# EAGLE design ME433_Spring2017 (EAGLE 8.1.0)
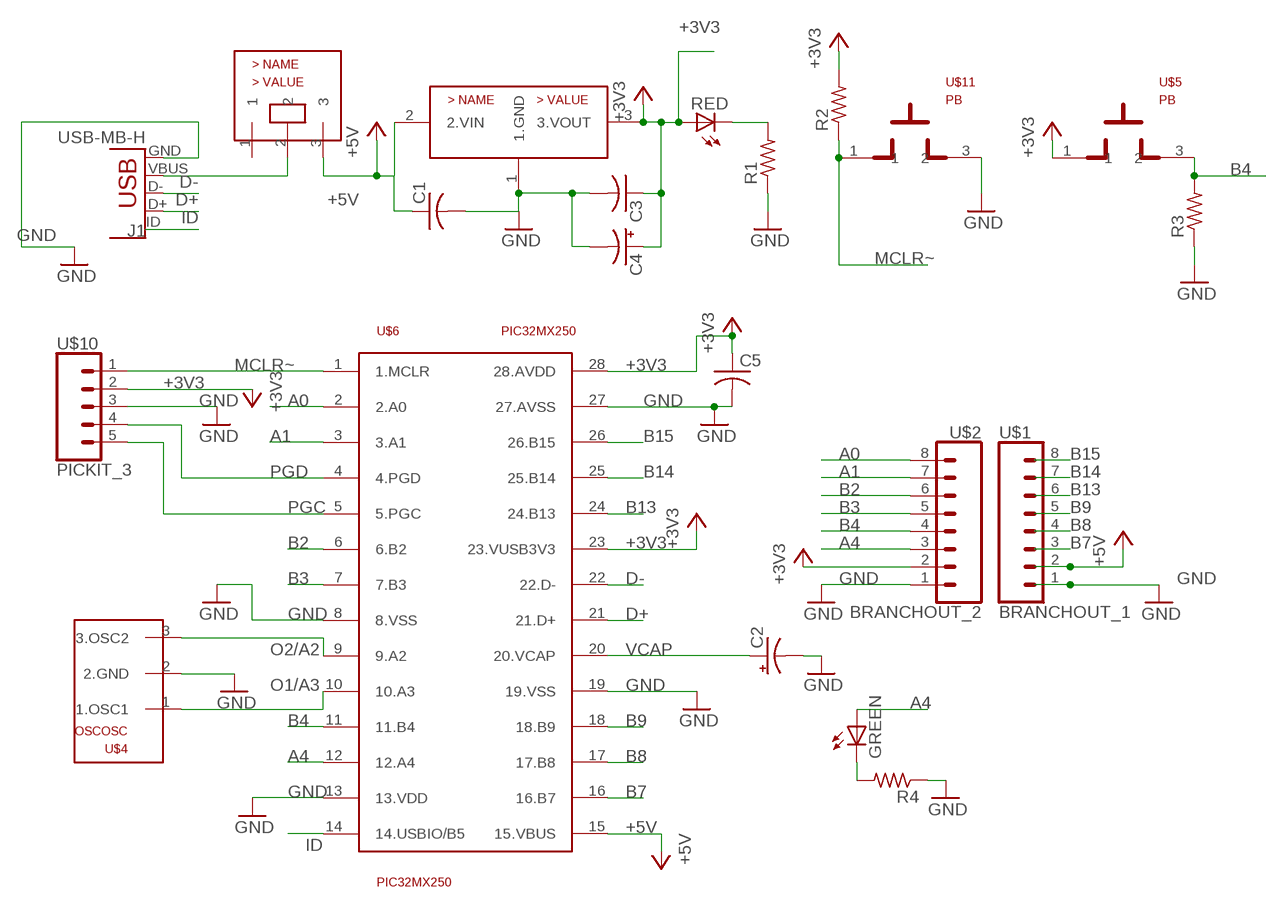
[diagram p0: schematic, sheet 1]

## Parts
_  MCP1702  [TO92]
C1  C-US025-025X050  [C025-025X050]
C2  CPOL-USB45181B  [B45181B]
C3  C-US025-025X050  [C025-025X050]
C4  CPOL-USB45181B  [B45181B]
C5  C-US025-025X050  [C025-025X050]
GREEN  LED3MM  [LED3MM]
J1  USB-MB-H  [USB-MB-H]
R1  R-US_0204/7  [0204/7]
R2  R-US_0204/7  [0204/7]
R3  R-US_0204/7  [0204/7]
R4  R-US_0204/7  [0204/7]
RED  LED3MM  [LED3MM]
U$1  BRANCHOUT_1  [1X08]
U$2  BRANCHOUT_2  [1X08]
U$4  OSCOSC  [OSC]
U$5  PB  [PB]
U$6  PIC32MX250  [DIL28-3]
U$8  SLIDE  [SLIDE]
U$10  PICKIT_3  [1X05]
U$11  PB  [PB]

## Nets
+3V3: _.3(3.VOUT) C3.1 C4.+ C5.1 R2.2 RED.A U$2.2 U$5.1 U$6.23(23.VUSB3V3) U$6.28(28.AVDD) U$10.2(2.VDD)
+5V: _.2(2.VIN) C1.1 U$1.2 U$6.15(15.VBUS) U$8.3
A0: U$2.8 U$6.2(2.A0)
A1: U$2.7 U$6.3(3.A1)
A4: GREEN.A U$2.3 U$6.12(12.A4)
B2: U$2.6 U$6.6(6.B2)
B3: U$2.5 U$6.7(7.B3)
B4: R3.2 U$2.4 U$5.3 U$6.11(11.B4)
B7: U$1.3 U$6.16(16.B7)
B8: U$1.4 U$6.17(17.B8)
B9: U$1.5 U$6.18(18.B9)
B13: U$1.6 U$6.24(24.B13)
B14: U$1.7 U$6.25(25.B14)
B15: U$1.8 U$6.26(26.B15)
D+: J1.D+ U$6.21(21.D+)
D-: J1.D- U$6.22(22.D-)
GND: _.1(1.GND) C1.2 C2.- C3.2 C4.- C5.2 J1.GND R1.1 R3.1 R4.1 U$1.1 U$2.1 U$4.2(2.GND) U$6.8(8.VSS) U$6.13(13.VDD) U$6.19(19.VSS) U$6.27(27.AVSS) U$10.3(3.VSS) U$11.3
ID: J1.ID U$6.14(14.USBIO/B5)
MCLR~: R2.1 U$6.1(1.MCLR) U$10.1(1.MCLR~) U$11.1
N$1: J1.VBUS U$8.2
N$18: R1.2 RED.K(C)
N$23: GREEN.K(C) R4.2
O1/A3: U$4.1(1.OSC1) U$6.10(10.A3)
O2/A2: U$4.3(3.OSC2) U$6.9(9.A2)
PGC: U$6.5(5.PGC) U$10.5(5.PGC)
PGD: U$6.4(4.PGD) U$10.4(4.PGD)
VCAP: C2.+ U$6.20(20.VCAP)
Unconnected: U$8.1

## Library data of the parts
_ = ME433_Spring2017:MCP1702
C1 C3 C5 = ME433_Spring2017:C-US: CAPACITOR, American symbol
C2 C4 = ME433_Spring2017:CPOL-US: POLARIZED CAPACITOR, American symbol
GREEN RED = ME433_Spring2017:LED: LED OSRAM: - CHIPLED LG R971, LG N971, LY N971, LG Q971, LY Q971, LO R971, LY R971 LH N974, LH R974 LS Q976, LO Q976, LY Q976 LO Q996 - Hyper CHIPLED LW Q18S LB Q993, LB Q99A, LB R99A - SideLED LS A670, LO A670, LY A670, LG A670, LP A670 LB A673, LV A673, LT A673, LW A673 LH A674 LY A675 LS A676, LA A676, LO A676, LY A676, LW A676 LS A679, LY A679, LG A679 - Hyper Micro SIDELED® LS Y876, LA Y876, LO Y876, LY Y876 LT Y87S - SmartLED LW L88C, LW L88S LB L89C, LB L89S, LG L890 LS L89K, LO L89K, LY L89K LS L896, LA L896, LO L896, LY L896 - TOPLED LS T670, LO T670, LY T670, LG T670, LP T670 LSG T670, LSP T670, LSY T670, LOP T670, LYG T670 LG T671, LOG T671, LSG T671 LB T673, LV T673, LT T673, LW T673 LH T674 LS T676, LA T676, LO T676, LY T676, LB T676, LH T676, LSB T676, LW T676 LB T67C, LV T67C, LT T67C, LS T67K, LO T67K, LY T67K, LW E67C LS E67B, LA E67B, LO E67B, LY E67B, LB E67C, LV E67C, LT E67C LW T67C LS T679, LY T679, LG T679 LS T770, LO T770, LY T770, LG T770, LP T770 LB T773, LV T773, LT T773, LW T773 LH T774 LS E675, LA E675, LY E675, LS T675 LS T776, LA T776, LO T776, LY T776, LB T776 LHGB T686 LT T68C, LB T68C - Hyper Mini TOPLED® LB M676 - Mini TOPLED Santana® LG M470 LS M47K, LO M47K, LY M47K Source: http://www.osram.convergy.de LUXEON: - LUMILED® LXK2-PW12-R00, LXK2-PW12-S00, LXK2-PW14-U00, LXK2-PW14-V00 LXK2-PM12-R00, LXK2-PM12-S00, LXK2-PM14-U00 LXK2-PE12-Q00, LXK2-PE12-R00, LXK2-PE12-S00, LXK2-PE14-T00, LXK2-PE14-U00 LXK2-PB12-K00, LXK2-PB12-L00, LXK2-PB12-M00, LXK2-PB14-N00, LXK2-PB14-P00, LXK2-PB14-Q00 LXK2-PR12-L00, LXK2-PR12-M00, LXK2-PR14-Q00, LXK2-PR14-R00 LXK2-PD12-Q00, LXK2-PD12-R00, LXK2-PD12-S00 LXK2-PH12-R00, LXK2-PH12-S00 LXK2-PL12-P00, LXK2-PL12-Q00, LXK2-PL12-R00 Source: www.luxeon.com KINGBRIGHT: KA-3528ASYC Source: www.kingbright.com
J1 = ME433_Spring2017:USB: USB Connectors USB-B-PTH is fully proven SKU : PRT-00139/CONN-08278 USB-miniB is fully proven SKU : PRT-00587 USB-A-PCB is untested. USB-A-H is throughly reviewed, but untested. Spark Fun Electronics SKU : PRT-00437 USB-B-SMT is throughly reviewed, but untested. Needs silkscreen touching up. USB-A-S has not been used/tested USB-MB-H has not been used/tested USB-MICROB has been used. CONN-09505
R1-R4 = ME433_Spring2017:R-US_: RESISTOR, American symbol
U$1 = ME433_Spring2017:BRANCHOUT_1
U$2 = ME433_Spring2017:BRANCHOUT_2
U$4 = ME433_Spring2017:OSC
U$5 U$11 = ME433_Spring2017:PB
U$6 = ME433_Spring2017:PIC32MX250
U$8 = ME433_Spring2017:SLIDE
U$10 = ME433_Spring2017:PICKIT_3

## Board
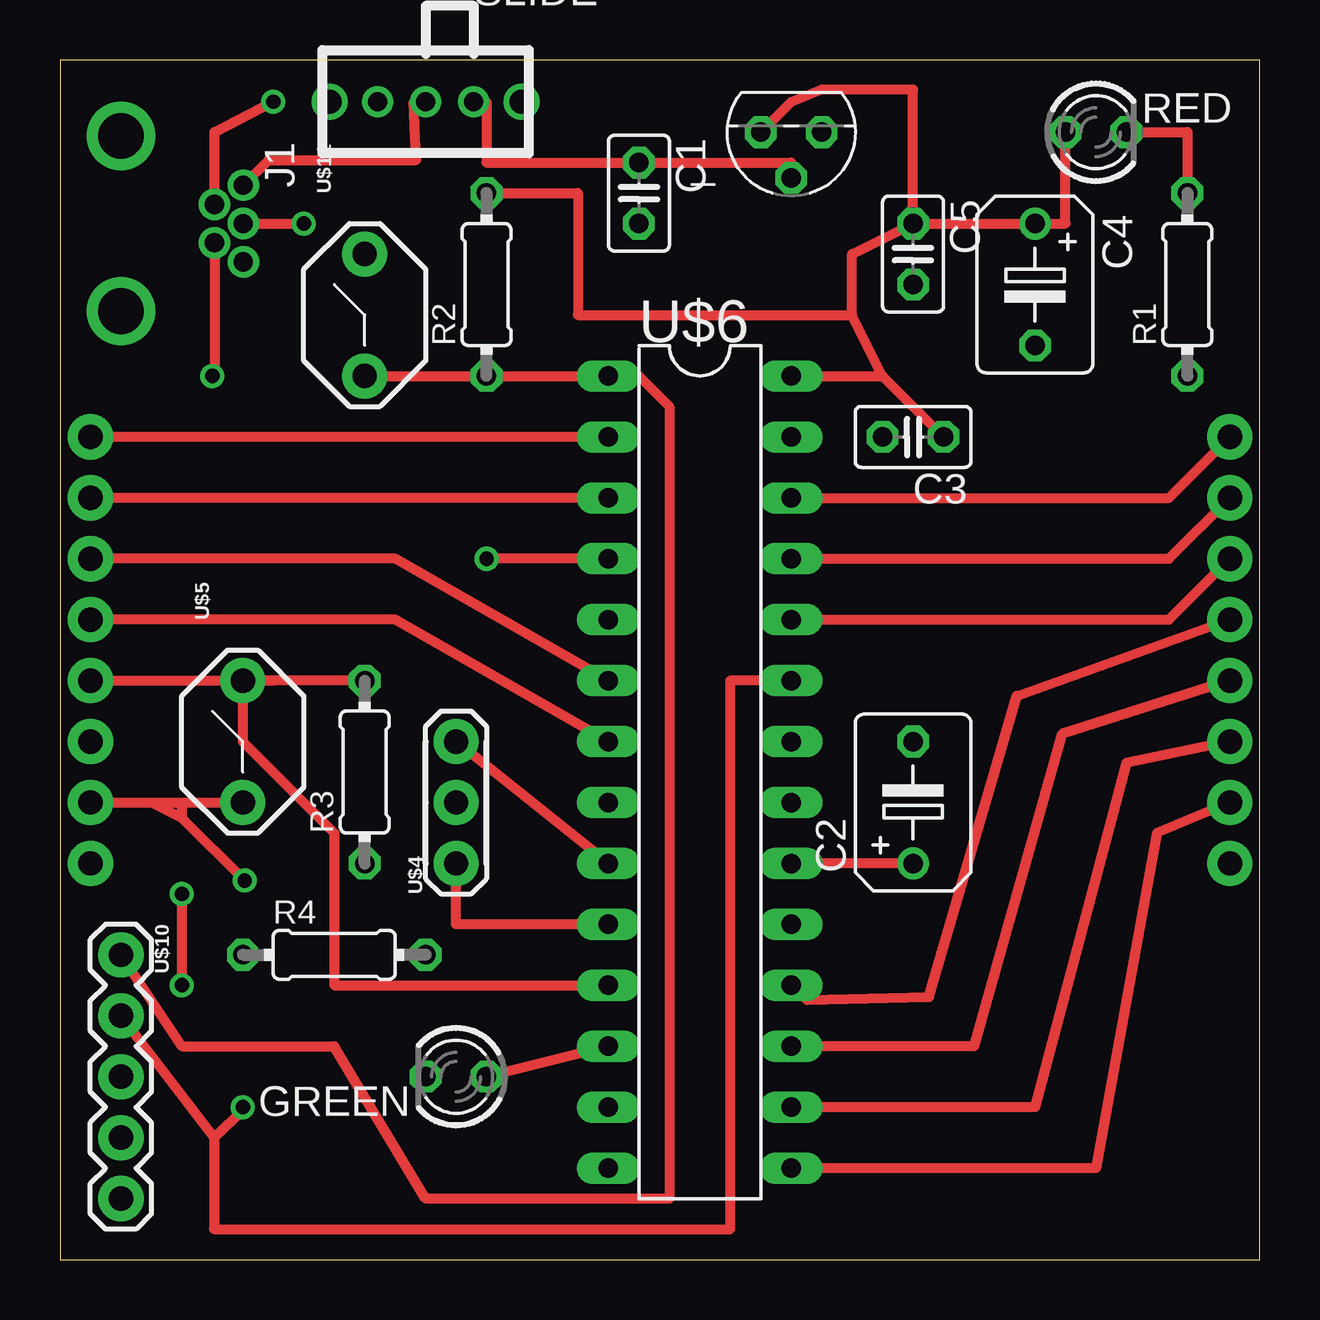
[diagram p1: board, top side]
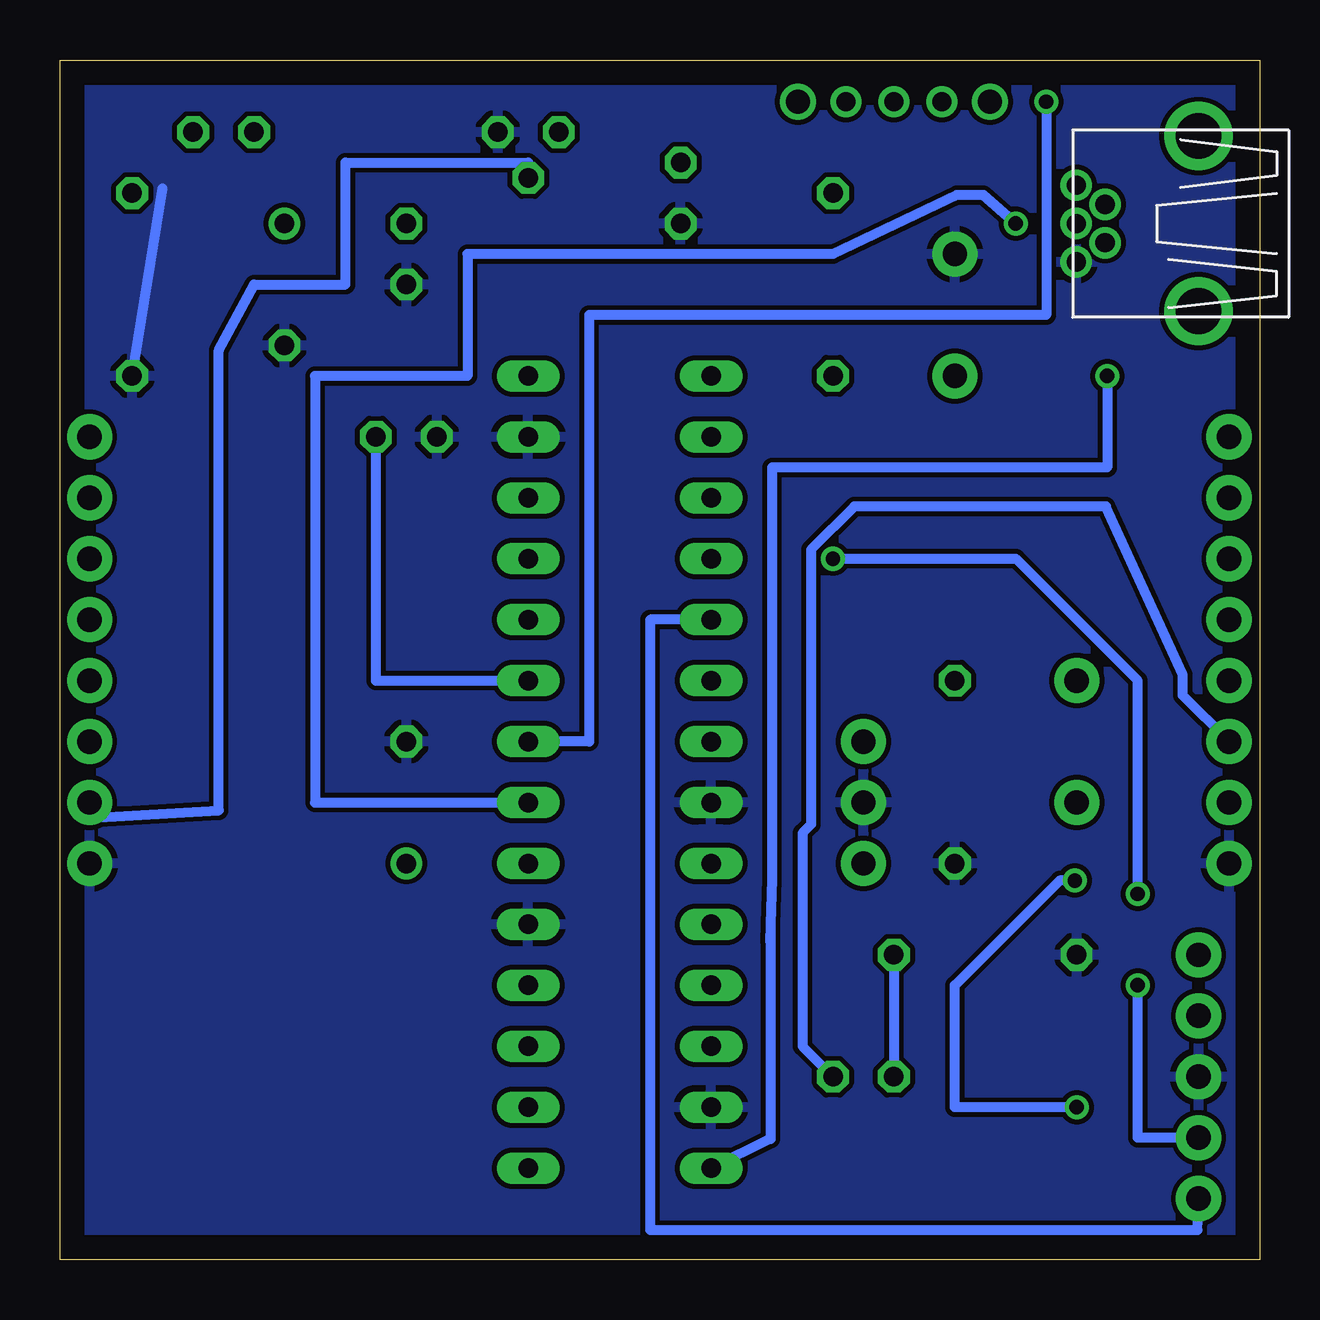
[diagram p2: board, bottom side, seen from below]

Size 50 x 50 mm. Coordinates in mm from the lower left corner, seen from the top.
Outline: 0,0 50,0 50,50 0,50 0,0
Copper layers (1*16): Top 0.035mm / dielectric 1.5mm / Bottom 0.035mm
Design rules "default": minimum track width 10mil, minimum drill 24mil, track to track 8mil, track to pad 8mil, pad to pad 8mil, via to via 8mil, smd to smd 8mil, copper to edge 40mil, drill to drill 8mil, minimum pad ring 10mil, minimum via ring 8mil, stop-mask expansion 4mil, vias tented up to drill 0mil, thermal gap 10mil

### Footprints (pad centres in the part's own frame; a part is rotated, then mirrored left to right if it is on the bottom)
TO92 = drill 0.813 octagon: 1 -1.27,0; 2 0,1.905; 3 1.27,0
C025-025X050 = drill 0.813 octagon: 1 -1.27,0; 2 1.27,0
B45181B = drill 0.813: + -2.54,0 | drill 0.813 octagon: - 2.54,0
LED3MM = drill 0.813 octagon: A -1.27,0; K 1.27,0
USB-MB-H = drill 0.8: D+ 5.1,0; D- 3.9,0.8; GND 5.1,-1.6; ID 3.9,-0.8; VBUS 5.1,1.6 | drill 1.9: P$6 0,-3.65; P$7 0,3.65
0204/7 = drill 0.813 octagon: 1 -3.81,0; 2 3.81,0
1X08 = drill 1.016 pad 1.88: 1 0,0; 2 2.54,0; 3 5.08,0; 4 7.62,0; 5 10.16,0; 6 12.7,0; 7 15.24,0; 8 17.78,0
OSC = drill 1.016 pad 1.88: 1 -2.54,0; 2 0,0; 3 2.54,0; 4 -2.54,0
PB = drill 1.016 pad 1.88: 1 -2.54,0; 3 2.54,0
DIL28-3 = drill 0.813 long: 1 -16.51,-3.81; 2 -13.97,-3.81; 3 -11.43,-3.81; 4 -8.89,-3.81; 5 -6.35,-3.81; 6 -3.81,-3.81; 7 -1.27,-3.81; 8 1.27,-3.81; 9 3.81,-3.81; 10 6.35,-3.81; 11 8.89,-3.81; 12 11.43,-3.81; 13 13.97,-3.81; 14 16.51,-3.81; 15 16.51,3.81; 16 13.97,3.81; 17 11.43,3.81; 18 8.89,3.81; 19 6.35,3.81; 20 3.81,3.81; 21 1.27,3.81; 22 -1.27,3.81; 23 -3.81,3.81; 24 -6.35,3.81; 25 -8.89,3.81; 26 -11.43,3.81; 27 -13.97,3.81; 28 -16.51,3.81
SLIDE = drill 0.8: 1 -2,0; 2 0,0; 3 2,0 | drill 1: S1 -4,0; S2 4,0
1X05 = drill 1.016 pad 1.88: 1 0,0; 2 2.54,0; 3 5.08,0; 4 7.62,0; 5 10.16,0

### Placement (x,y rotation side)
_  30.48,46.99 180 top
C1  24.13,44.45 270 top
C2  35.56,19.05 90 top
C3  35.56,34.29 180 top
C4  40.64,40.64 270 top
C5  35.56,41.91 270 top
GREEN  16.51,7.62 180 top
J1  2.54,43.18 0 top
R1  46.99,40.64 90 top
R2  17.78,40.64 90 top
R3  12.7,20.32 90 top
R4  11.43,12.7 0 top
RED  43.18,46.99 0 top
U$1  48.77,16.51 90 top
U$2  BRANCHOUT_1  [1X08]  1.27,16.51 90 top
U$4  16.51,19.05 90 top
U$5  7.62,21.59 90 top
U$6  26.67,20.32 270 top
U$8  15.24,48.26 0 top
U$10  2.54,12.7 270 top
U$11  12.7,39.37 90 top

### Tracks (layer width: path | path; a pad name or v marks a point on that pad's centre or on a via)
+3V3  (via drill 0.6)
  Top 0.406: _.3 30.48,48.26 31.75,48.78 35.56,48.78 C5.1 | C5.1 C4.+ 41.91,43.18 RED.A | U$6.28 34.29,36.83 | R2.2 21.59,44.45 21.59,39.37 33.02,39.37 | 33.02,39.37 33.02,41.91 C5.1 | C3.1 34.29,36.83 | 34.29,36.83 33.02,39.37 | U$2.2 3.81,19.05 | 3.81,19.05 5.08,19.05 | 5.08,19.05 5.08,18.41 | 5.08,19.05 U$5.1 | 5.08,18.41 v7.7,15.8 | 5.08,18.41 3.81,19.05 | U$10.2 6.43,5.08 | U$6.23 27.94,24.13 27.94,1.27 6.43,1.27 6.43,5.08 | 6.43,5.08 7.7,6.27 v7.62,6.35
  Bottom 0.406: U$6.23 36.83,24.13 C3.1 | v7.7,15.8 8.33,15.8 12.7,11.43 12.7,6.35 v7.62,6.35
+5V
  Top 0.406: U$8.3 17.78,48.26 17.78,45.72 C1.1 30.48,45.72 _.2 | U$1.2 45.72,17.78 43.18,3.81 U$6.15
  Bottom 0.406: U$1.2 48.77,18.42 43.38,18.72 43.38,37.9 41.91,40.64 38.1,40.64 38.1,45.72 30.48,45.72 _.2
A0
  Top 0.406: U$6.2 U$2.8
A1
  Top 0.406: U$6.3 U$2.7
A4
  Top 0.406: U$6.12 GREEN.A
  Bottom 0.406: U$2.3 3.2,23.52 3.2,24.38 6.4,31.39 16.89,31.39 18.69,29.59 18.69,18.14 19.05,17.78 19.05,8.89 GREEN.A
B2
  Top 0.406: U$6.6 13.97,29.21 U$2.6
B3
  Top 0.406: U$6.7 13.97,26.67 U$2.5
B4
  Top 0.406: U$6.11 11.43,11.43 11.43,17.78 7.62,21.59 U$5.3 | R3.2 U$5.3 | U$2.4 U$5.3 | U$5.3 8.89,24.13
B7
  Top 0.406: U$1.3 44.45,20.7 40.64,6.35 U$6.16
B8
  Top 0.406: U$1.4 41.77,21.9 38.1,8.89 U$6.17
B9
  Top 0.406: U$6.18 31.14,10.82 36.22,10.95 39.88,23.49 U$1.5
B13
  Top 0.406: U$6.24 46.23,26.67 U$1.6
B14
  Top 0.406: U$6.25 46.23,29.21 U$1.7
B15
  Top 0.406: U$6.26 46.23,31.75 U$1.8
D+  (via drill 0.6)
  Top 0.406: J1.D+ v10.16,43.18
  Bottom 0.406: v10.16,43.18 11.51,44.37 12.62,44.37 17.78,41.91 33.02,41.91 33.02,36.83 39.37,36.83 39.37,19.05 U$6.21
D-  (via drill 0.6)
  Top 0.406: J1.D- 6.44,46.99 v8.89,48.26
  Bottom 0.406: v8.89,48.26 8.89,39.37 27.94,39.37 27.94,21.59 U$6.22
GND
  Bottom 0.406: R1.1 45.72,44.65
  pour Bottom: 0,49.53 0,0 49.53,0 49.53,1.27 49.53,49.53
ID  (via drill 0.6)
  Top 0.406: J1.ID 6.44,36.83 v6.35,36.83
  Bottom 0.406: v6.35,36.83 6.35,33.02 20.32,33.02 20.32,15.87 20.38,13.97 | 20.38,13.97 20.4,13.26 | 20.38,13.97 20.38,5.03 U$6.14
MCLR~
  Top 0.406: U$11.1 R2.1 U$6.1 24.13,36.83 25.4,35.56 25.4,2.54 15.24,2.54 11.43,8.89 5.08,8.89 U$10.1
N$1
  Top 0.406: J1.VBUS 8.69,45.83 14.85,45.83 14.74,48.26 U$8.2
N$18
  Top 0.406: RED.K 46.99,46.99 R1.2
N$23
  Bottom 0.406: R4.2 GREEN.K
O1/A3
  Top 0.406: U$6.10 16.51,13.97 U$4.1
O2/A2
  Top 0.406: U$6.9 U$4.3
PGC
  Bottom 0.406: U$10.5 2.59,1.22 25.4,1.22 25.4,26.67 U$6.5
PGD  (via drill 0.6)
  Top 0.406: U$6.4 v17.78,29.21 | v5.08,15.24 v5.08,11.43
  Bottom 0.406: v17.78,29.21 10.16,29.21 5.08,24.13 v5.08,15.24 | U$10.4 5.08,5.08 v5.08,11.43
VCAP
  Top 0.406: C2.+ U$6.20